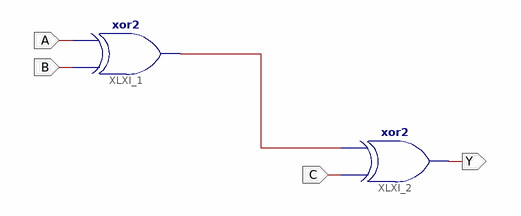
[diagram p0: schematic sheet 1]
// Xilinx ISE schematic MINORITY.sch (spartan6) as structural Verilog: 2 symbols, 4 ports
module MINORITY (
  input  A,
  input  B,
  input  C,
  output Y
);

  wire XLXN_1;

  xor XLXI_1 (XLXN_1, B, A);
  xor XLXI_2 (Y, C, XLXN_1);
endmodule
